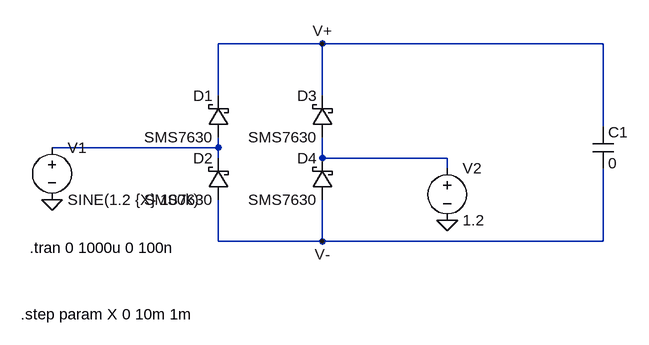
[diagram p0: schematic rectifier.asc]
rectifier.asc, the LTspice schematic file:
Version 4
SHEET 1 1700 680
WIRE 1136 0 976 0
WIRE 1568 0 1136 0
WIRE 976 80 976 0
WIRE 1136 80 1136 0
WIRE 1568 128 1568 0
WIRE 976 160 976 144
WIRE 976 160 720 160
WIRE 976 176 976 160
WIRE 1136 176 1136 144
WIRE 1328 176 1136 176
WIRE 1136 192 1136 176
WIRE 1328 192 1328 176
WIRE 976 304 976 240
WIRE 1136 304 1136 240
WIRE 1136 304 976 304
WIRE 1568 304 1568 192
WIRE 1568 304 1136 304
FLAG 1328 272 0
FLAG 720 240 0
FLAG 1136 0 V+
FLAG 1136 304 V-
SYMBOL schottky 992 240 R180
WINDOW 0 24 64 Left 2
WINDOW 3 24 0 Left 2
SYMATTR InstName D2
SYMATTR Value SMS7630
SYMATTR Description Diode
SYMATTR Type diode
SYMBOL schottky 1152 144 R180
WINDOW 0 24 64 Left 2
WINDOW 3 24 0 Left 2
SYMATTR InstName D3
SYMATTR Value SMS7630
SYMATTR Description Diode
SYMATTR Type diode
SYMBOL schottky 1152 240 R180
WINDOW 0 24 64 Left 2
WINDOW 3 24 0 Left 2
SYMATTR InstName D4
SYMATTR Value SMS7630
SYMATTR Description Diode
SYMATTR Type diode
SYMBOL schottky 992 144 R180
WINDOW 0 24 64 Left 2
WINDOW 3 24 0 Left 2
SYMATTR InstName D1
SYMATTR Value SMS7630
SYMATTR Description Diode
SYMATTR Type diode
SYMBOL voltage 1328 176 R0
WINDOW 123 0 0 Left 0
WINDOW 39 0 0 Left 0
SYMATTR InstName V2
SYMATTR Value 1.2
SYMBOL cap 1552 128 R0
SYMATTR InstName C1
SYMATTR Value 0
SYMBOL voltage 720 144 R0
WINDOW 123 0 0 Left 0
WINDOW 39 0 0 Left 0
SYMATTR InstName V1
SYMATTR Value SINE(1.2 {X} 100k)
TEXT 686 314 Left 2 !.tran 0 1000u 0 100n
TEXT 672 416 Left 2 !.step param X 0 10m 1m

The netlist it stands for:
* rectifier.asc
D2 V- N001 SMS7630
D3 N002 V+ SMS7630
D4 V- N002 SMS7630
D1 N001 V+ SMS7630
V2 N002 0 1.2
C1 V+ V- 0
V1 N001 0 SINE(1.2 {X} 100k)
.model D D
.lib standard.dio
.tran 0 1000u 0 100n
.step param X 0 10m 1m
.backanno
.end